# EAGLE design brake_light (EAGLE 8.4.3)
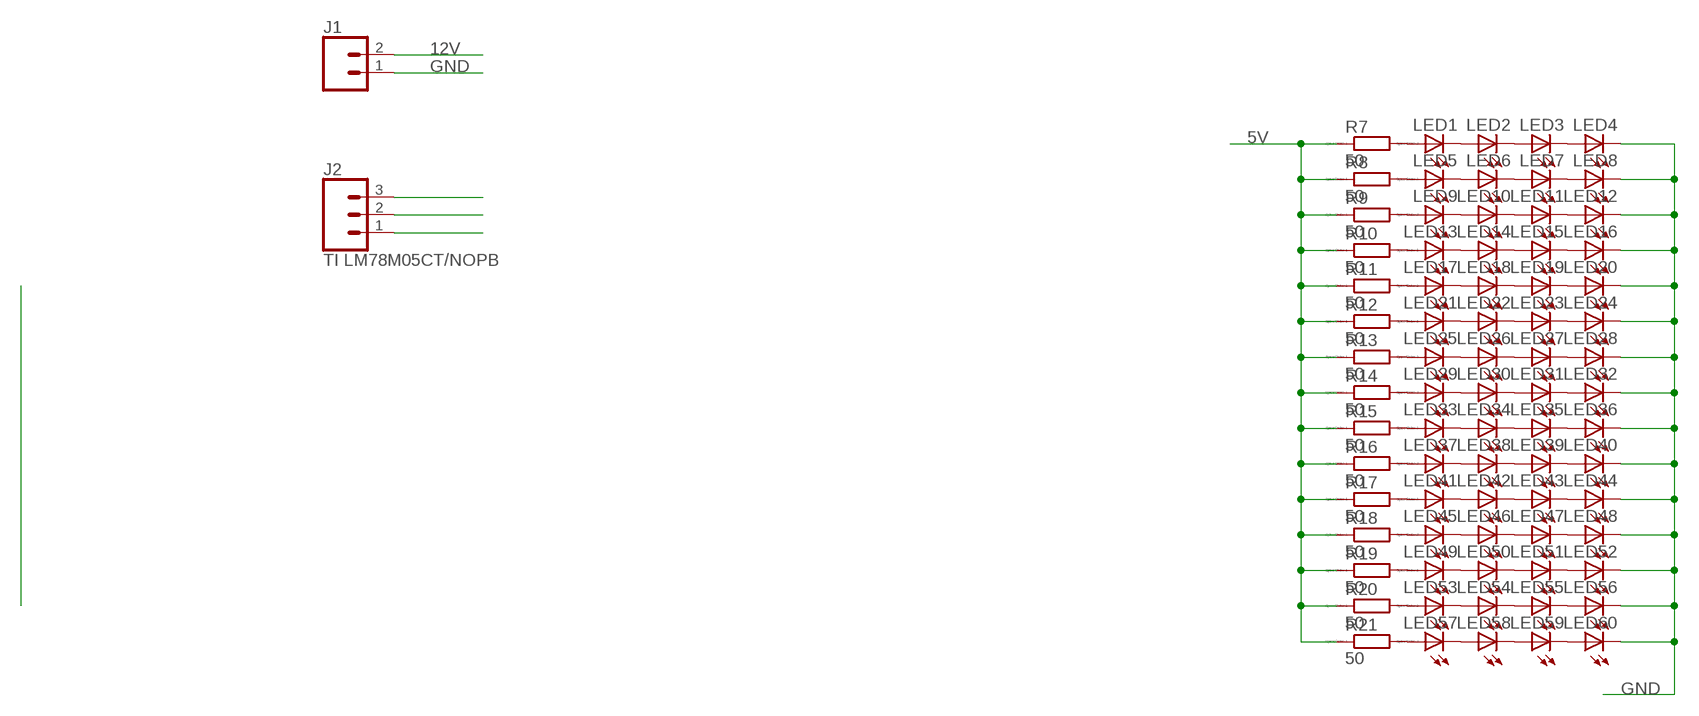
[diagram p0: schematic, sheet 1]

## Parts
J1  CONN_02  [1X02]
J2  TI LM78M05CT/NOPB  CONN_03  [1X03]
LED1  LED5MM  [LED5MM]
LED2  LED5MM  [LED5MM]
LED3  LED5MM  [LED5MM]
LED4  LED5MM  [LED5MM]
LED5  LED5MM  [LED5MM]
LED6  LED5MM  [LED5MM]
LED7  LED5MM  [LED5MM]
LED8  LED5MM  [LED5MM]
LED9  LED5MM  [LED5MM]
LED10  LED5MM  [LED5MM]
LED11  LED5MM  [LED5MM]
LED12  LED5MM  [LED5MM]
LED13  LED5MM  [LED5MM]
LED14  LED5MM  [LED5MM]
LED15  LED5MM  [LED5MM]
LED16  LED5MM  [LED5MM]
LED17  LED5MM  [LED5MM]
LED18  LED5MM  [LED5MM]
LED19  LED5MM  [LED5MM]
LED20  LED5MM  [LED5MM]
LED21  LED5MM  [LED5MM]
LED22  LED5MM  [LED5MM]
LED23  LED5MM  [LED5MM]
LED24  LED5MM  [LED5MM]
LED25  LED5MM  [LED5MM]
LED26  LED5MM  [LED5MM]
LED27  LED5MM  [LED5MM]
LED28  LED5MM  [LED5MM]
LED29  LED5MM  [LED5MM]
LED30  LED5MM  [LED5MM]
LED31  LED5MM  [LED5MM]
LED32  LED5MM  [LED5MM]
LED33  LED5MM  [LED5MM]
LED34  LED5MM  [LED5MM]
LED35  LED5MM  [LED5MM]
LED36  LED5MM  [LED5MM]
LED37  LED5MM  [LED5MM]
LED38  LED5MM  [LED5MM]
LED39  LED5MM  [LED5MM]
LED40  LED5MM  [LED5MM]
LED41  LED5MM  [LED5MM]
LED42  LED5MM  [LED5MM]
LED43  LED5MM  [LED5MM]
LED44  LED5MM  [LED5MM]
LED45  LED5MM  [LED5MM]
LED46  LED5MM  [LED5MM]
LED47  LED5MM  [LED5MM]
LED48  LED5MM  [LED5MM]
LED49  LED5MM  [LED5MM]
LED50  LED5MM  [LED5MM]
LED51  LED5MM  [LED5MM]
LED52  LED5MM  [LED5MM]
LED53  LED5MM  [LED5MM]
LED54  LED5MM  [LED5MM]
LED55  LED5MM  [LED5MM]
LED56  LED5MM  [LED5MM]
LED57  LED5MM  [LED5MM]
LED58  LED5MM  [LED5MM]
LED59  LED5MM  [LED5MM]
LED60  LED5MM  [LED5MM]
R7  50  RR1206  [R1206]
R8  50  RR1206  [R1206]
R9  50  RR1206  [R1206]
R10  50  RR1206  [R1206]
R11  50  RR1206  [R1206]
R12  50  RR1206  [R1206]
R13  50  RR1206  [R1206]
R14  50  RR1206  [R1206]
R15  50  RR1206  [R1206]
R16  50  RR1206  [R1206]
R17  50  RR1206  [R1206]
R18  50  RR1206  [R1206]
R19  50  RR1206  [R1206]
R20  50  RR1206  [R1206]
R21  50  RR1206  [R1206]

## Nets
5V: J2.3 R7.1 R8.1 R9.1 R10.1 R11.1 R12.1 R13.1 R14.1 R15.1 R16.1 R17.1 R18.1 R19.1 R20.1 R21.1
12V: J1.2 J2.1
GND: J1.1 J2.2 LED4.K(C) LED8.K(C) LED12.K(C) LED16.K(C) LED20.K(C) LED24.K(C) LED28.K(C) LED32.K(C) LED36.K(C) LED40.K(C) LED44.K(C) LED48.K(C) LED52.K(C) LED56.K(C) LED60.K(C)
N$10: LED1.A R7.2
N$11: LED1.K(C) LED2.A
N$12: LED2.K(C) LED3.A
N$13: LED3.K(C) LED4.A
N$14: LED5.A R8.2
N$15: LED5.K(C) LED6.A
N$16: LED6.K(C) LED7.A
N$17: LED7.K(C) LED8.A
N$18: LED9.A R9.2
N$19: LED9.K(C) LED10.A
N$20: LED10.K(C) LED11.A
N$21: LED11.K(C) LED12.A
N$22: LED13.A R10.2
N$23: LED13.K(C) LED14.A
N$24: LED14.K(C) LED15.A
N$25: LED15.K(C) LED16.A
N$26: LED17.A R11.2
N$27: LED17.K(C) LED18.A
N$28: LED18.K(C) LED19.A
N$29: LED19.K(C) LED20.A
N$30: LED21.A R12.2
N$31: LED21.K(C) LED22.A
N$32: LED22.K(C) LED23.A
N$33: LED23.K(C) LED24.A
N$34: LED25.A R13.2
N$35: LED25.K(C) LED26.A
N$36: LED26.K(C) LED27.A
N$37: LED27.K(C) LED28.A
N$38: LED29.A R14.2
N$39: LED29.K(C) LED30.A
N$40: LED30.K(C) LED31.A
N$41: LED31.K(C) LED32.A
N$42: LED33.A R15.2
N$43: LED33.K(C) LED34.A
N$44: LED34.K(C) LED35.A
N$45: LED35.K(C) LED36.A
N$46: LED37.A R16.2
N$47: LED37.K(C) LED38.A
N$48: LED38.K(C) LED39.A
N$49: LED39.K(C) LED40.A
N$50: LED41.A R17.2
N$51: LED41.K(C) LED42.A
N$52: LED42.K(C) LED43.A
N$53: LED43.K(C) LED44.A
N$54: LED45.A R18.2
N$55: LED45.K(C) LED46.A
N$56: LED46.K(C) LED47.A
N$57: LED47.K(C) LED48.A
N$58: LED49.A R19.2
N$59: LED49.K(C) LED50.A
N$60: LED50.K(C) LED51.A
N$61: LED51.K(C) LED52.A
N$62: LED53.A R20.2
N$63: LED53.K(C) LED54.A
N$64: LED54.K(C) LED55.A
N$65: LED55.K(C) LED56.A
N$66: LED57.A R21.2
N$67: LED57.K(C) LED58.A
N$68: LED58.K(C) LED59.A
N$69: LED59.K(C) LED60.A

## Library data of the parts
J1 = SparkFun-Connectors:CONN_02: Multi connection point. Often used as Generic Header-pin footprint for 0.1 inch spaced/style header connections On any of the 0.1 inch spaced packages, you can populate with these: Break Away Headers - Straight <https://www.sparkfun.com/products/116> (PRT-00116) Break Away Male Headers - Right Angle <https://www.sparkfun.com/products/553> (PRT-00553) Female Headers <https://www.sparkfun.com/products/115> (PRT-00115) Break Away Headers - Machine Pin <https://www.sparkfun.com/products/117> (PRT-00117) Break Away Female Headers - Swiss Machine Pin <https://www.sparkfun.com/products/743> (PRT-00743) For SCREWTERMINALS and SPRING TERMINALS visit here: Screw Terimnals on SparkFun.com <https://www.sparkfun.com/search/results?term=Screw+Terminals> (5mm/3.5mm/2.54mm spacing) This device is also useful as a general connection point to wire up your design to another part of your project. Our various solder wires solder well into these plated through hole pads. Hook-Up Wire - Assortment (Stranded, 22 AWG) <https://www.sparkfun.com/products/11375> (PRT-11375) Hook-Up Wire - Assortment (Solid Core, 22 AWG) <https://www.sparkfun.com/products/11367> (PRT-11367) View the entire wire category on our website here <https://www.sparkfun.com/categories/141> Special notes: Molex polarized connector foot print use with: PRT-08233 with associated crimp pins and housings. 2.54_SCREWTERM for use with PRT-10571. 3.5mm Screw Terminal footprints for PRT-08084 5mm Screw Terminal footprints for use with PRT-08432
J2 = SparkFun-Connectors:CONN_03: Multi connection point. Often used as Generic Header-pin footprint for 0.1 inch spaced/style header connections On any of the 0.1 inch spaced packages, you can populate with these: Break Away Headers - Straight <https://www.sparkfun.com/products/116> (PRT-00116) Break Away Male Headers - Right Angle <https://www.sparkfun.com/products/553> (PRT-00553) Female Headers <https://www.sparkfun.com/products/115> (PRT-00115) Break Away Headers - Machine Pin <https://www.sparkfun.com/products/117> (PRT-00117) Break Away Female Headers - Swiss Machine Pin <https://www.sparkfun.com/products/743> (PRT-00743) Stackable Header - 3 Pin (Female, 0.1") <https://www.sparkfun.com/products/13875> (PRT-13875) For SCREWTERMINALS and SPRING TERMINALS visit here: Screw Terimnals on SparkFun.com <https://www.sparkfun.com/search/results?term=Screw+Terminals> (5mm/3.5mm/2.54mm spacing) This device is also useful as a general connection point to wire up your design to another part of your project. Our various solder wires solder well into these plated through hole pads. Hook-Up Wire - Assortment (Stranded, 22 AWG) <https://www.sparkfun.com/products/11375> (PRT-11375) Hook-Up Wire - Assortment (Solid Core, 22 AWG) <https://www.sparkfun.com/products/11367> (PRT-11367) View the entire wire category on our website here <https://www.sparkfun.com/categories/141> Special notes: Molex polarized connector foot print use with SKU : PRT-08232 with associated crimp pins and housings.; PROD_ID: XXX-00000; VALUE: 455-1750-1-ND
LED1-LED60 = adafruit:LED: LED OSRAM: - CHIPLED LG R971, LG N971, LY N971, LG Q971, LY Q971, LO R971, LY R971 LH N974, LH R974 LS Q976, LO Q976, LY Q976 LO Q996 - Hyper CHIPLED LW Q18S LB Q993, LB Q99A, LB R99A - SideLED LS A670, LO A670, LY A670, LG A670, LP A670 LB A673, LV A673, LT A673, LW A673 LH A674 LY A675 LS A676, LA A676, LO A676, LY A676, LW A676 LS A679, LY A679, LG A679 - Hyper Micro SIDELED® LS Y876, LA Y876, LO Y876, LY Y876 LT Y87S - SmartLED LW L88C, LW L88S LB L89C, LB L89S, LG L890 LS L89K, LO L89K, LY L89K LS L896, LA L896, LO L896, LY L896 - TOPLED LS T670, LO T670, LY T670, LG T670, LP T670 LSG T670, LSP T670, LSY T670, LOP T670, LYG T670 LG T671, LOG T671, LSG T671 LB T673, LV T673, LT T673, LW T673 LH T674 LS T676, LA T676, LO T676, LY T676, LB T676, LH T676, LSB T676, LW T676 LB T67C, LV T67C, LT T67C, LS T67K, LO T67K, LY T67K, LW E67C LS E67B, LA E67B, LO E67B, LY E67B, LB E67C, LV E67C, LT E67C LW T67C LS T679, LY T679, LG T679 LS T770, LO T770, LY T770, LG T770, LP T770 LB T773, LV T773, LT T773, LW T773 LH T774 LS E675, LA E675, LY E675, LS T675 LS T776, LA T776, LO T776, LY T776, LB T776 LHGB T686 LT T68C, LB T68C - Hyper Mini TOPLED® LB M676 - Mini TOPLED Santana® LG M470 LS M47K, LO M47K, LY M47K Source: http://www.osram.convergy.de/
R7-R21 = eagle-ltspice:R: RESISTOR, European symbol; SPICEMODEL: NONE; SPICEPREFIX: R

## Board
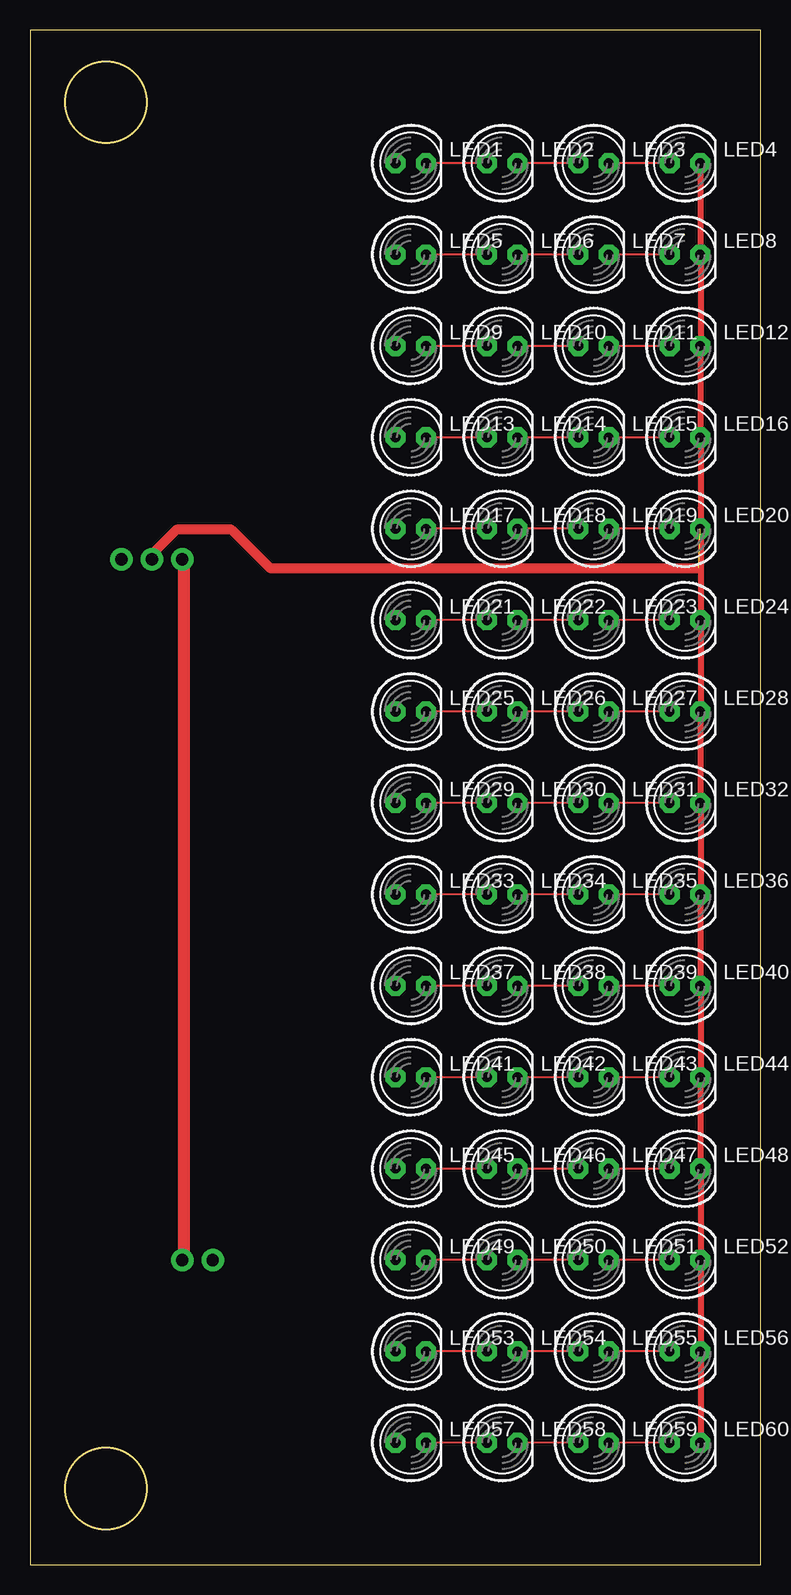
[diagram p1: board, top side]
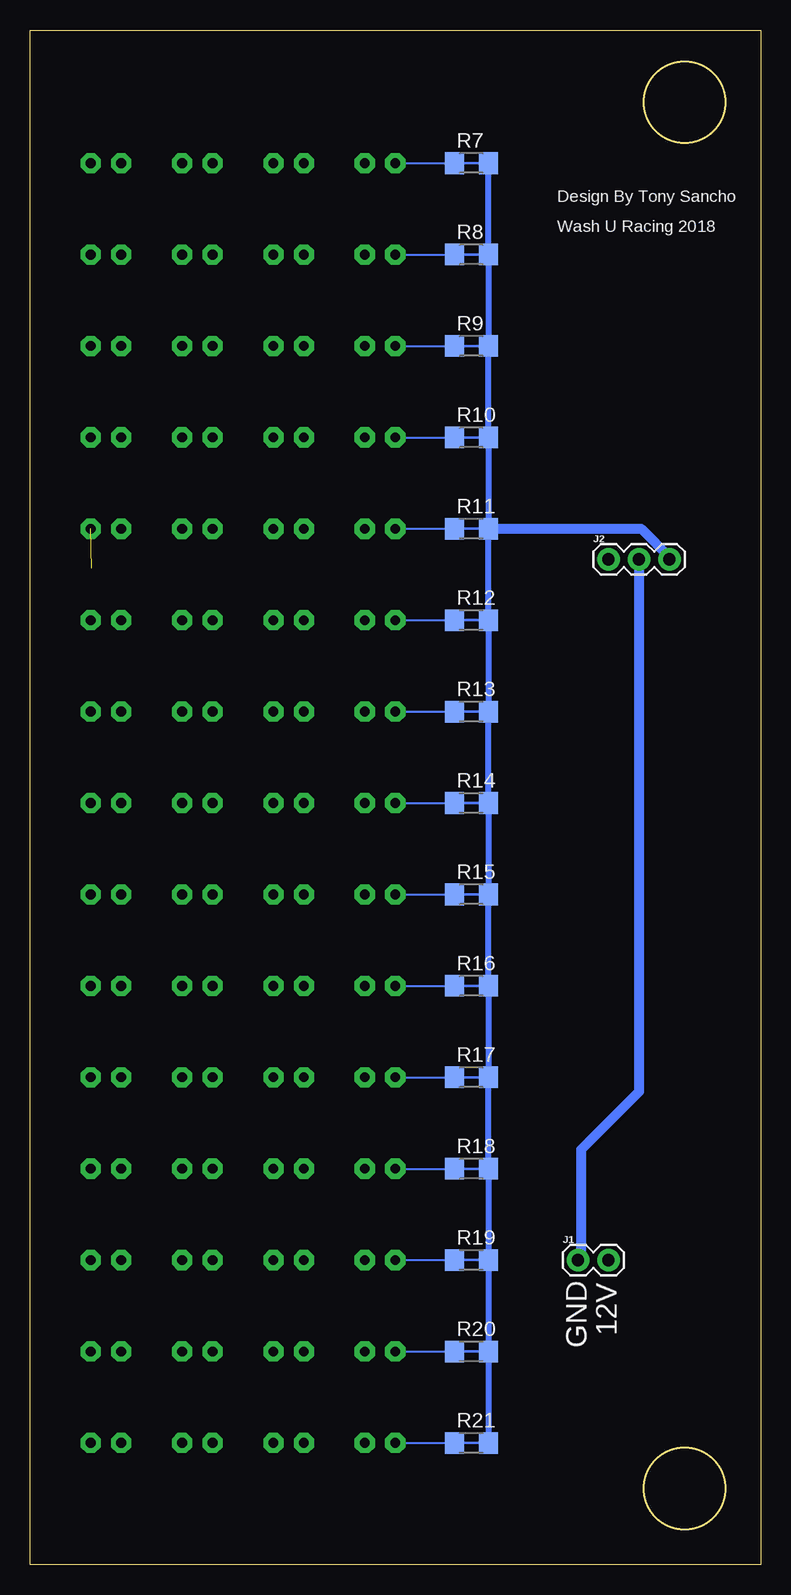
[diagram p2: board, bottom side, seen from below]

Size 60.94 x 127.94 mm. Coordinates in mm from the lower left corner, seen from the top.
Outline: 0,0 60.94,0 60.94,127.94 0,127.94 0,0
Outline: circle at 6.35,121.92 radius 3.4
Outline: circle at 6.35,6.35 radius 3.4
Copper layers (1*16): Top 0.035mm / dielectric 1.5mm / Bottom 0.035mm
Design rules "default": minimum track width 6mil, minimum drill 0.35mm, track to track 6mil, track to pad 6mil, pad to pad 6mil, via to via 6mil, smd to smd 6mil, copper to edge 40mil, drill to drill 6mil, minimum pad ring 10mil, minimum via ring 8mil, stop-mask expansion 4mil, vias tented up to drill 0mil, thermal gap 10mil

### Footprints (pad centres in the part's own frame; a part is rotated, then mirrored left to right if it is on the bottom)
1X02 = drill 1.016 pad 1.88: 1 0,0; 2 2.54,0
1X03 = drill 1.016 pad 1.88: 1 0,0; 2 2.54,0; 3 5.08,0
LED5MM = drill 0.813 pad 1.676 octagon: A -1.27,0; K 1.27,0
R1206 = smd 1.6 x 1.803: 1 -1.422,0; 2 1.422,0

### Placement (x,y rotation side)
J1  15.24,25.4 0 bottom
J2  12.7,83.82 0 bottom
LED1  31.75,116.84 0 top
LED2  39.37,116.84 0 top
LED3  46.99,116.84 0 top
LED4  54.61,116.84 0 top
LED5  31.75,109.22 0 top
LED6  39.37,109.22 0 top
LED7  46.99,109.22 0 top
LED8  54.61,109.22 0 top
LED9  31.75,101.6 0 top
LED10  39.37,101.6 0 top
LED11  46.99,101.6 0 top
LED12  54.61,101.6 0 top
LED13  31.75,93.98 0 top
LED14  39.37,93.98 0 top
LED15  46.99,93.98 0 top
LED16  54.61,93.98 0 top
LED17  31.75,86.36 0 top
LED18  39.37,86.36 0 top
LED19  46.99,86.36 0 top
LED20  54.61,86.36 0 top
LED21  31.75,78.74 0 top
LED22  39.37,78.74 0 top
LED23  46.99,78.74 0 top
LED24  54.61,78.74 0 top
LED25  31.75,71.12 0 top
LED26  39.37,71.12 0 top
LED27  46.99,71.12 0 top
LED28  54.61,71.12 0 top
LED29  31.75,63.5 0 top
LED30  39.37,63.5 0 top
LED31  46.99,63.5 0 top
LED32  54.61,63.5 0 top
LED33  31.75,55.88 0 top
LED34  39.37,55.88 0 top
LED35  46.99,55.88 0 top
LED36  54.61,55.88 0 top
LED37  31.75,48.26 0 top
LED38  39.37,48.26 0 top
LED39  46.99,48.26 0 top
LED40  54.61,48.26 0 top
LED41  31.75,40.64 0 top
LED42  39.37,40.64 0 top
LED43  46.99,40.64 0 top
LED44  54.61,40.64 0 top
LED45  31.75,33.02 0 top
LED46  39.37,33.02 0 top
LED47  46.99,33.02 0 top
LED48  54.61,33.02 0 top
LED49  31.75,25.4 0 top
LED50  39.37,25.4 0 top
LED51  46.99,25.4 0 top
LED52  54.61,25.4 0 top
LED53  31.75,17.78 0 top
LED54  39.37,17.78 0 top
LED55  46.99,17.78 0 top
LED56  54.61,17.78 0 top
LED57  31.75,10.16 0 top
LED58  39.37,10.16 0 top
LED59  46.99,10.16 0 top
LED60  54.61,10.16 0 top
R7  24.13,116.84 0 bottom
R8  24.13,109.22 0 bottom
R9  24.13,101.6 0 bottom
R10  24.13,93.98 0 bottom
R11  24.13,86.36 0 bottom
R12  24.13,78.74 0 bottom
R13  24.13,71.12 0 bottom
R14  24.13,63.5 0 bottom
R15  24.13,55.88 0 bottom
R16  24.13,48.26 0 bottom
R17  24.13,40.64 0 bottom
R18  24.13,33.02 0 bottom
R19  24.13,25.4 0 bottom
R20  24.13,17.78 0 bottom
R21  24.13,10.16 0 bottom

### Tracks (layer width: path | path; a pad name or v marks a point on that pad's centre or on a via)
5V  (via drill 0.35)
  Top 0.152: v7.53,83.92 7.62,83.92 J2.3
  Bottom 0.152: 22.71,116.84 R7.1 | 22.71,109.22 R8.1 | 22.71,101.6 R9.1 | 22.71,93.98 R10.1 | 22.71,10.16 R21.1 | 22.71,17.78 R20.1 | 22.71,25.4 R19.1 | 22.71,40.64 R17.1 | 22.71,33.02 R18.1 | 22.71,55.88 R15.1 | 22.71,48.26 R16.1 | 22.71,71.12 R13.1 | 22.71,63.5 R14.1 | 22.71,86.36 R11.1 | 22.71,78.74 R12.1
  Bottom 0.508: 22.71,116.84 22.71,109.22 22.71,101.6 22.71,93.98 22.71,86.36 22.71,78.74 22.71,71.12 22.71,63.5 22.71,55.88 22.71,48.26 22.71,40.64 22.71,33.02 22.71,25.4 22.71,17.78 22.71,10.16
  Bottom 0.813: v7.53,83.92 9.97,86.36 22.71,86.36
12V
  Top 0.152: 12.8,25.4 J1.2 | 12.8,83.77 J2.1
  Top 1.016: 12.8,83.77 12.8,25.4
GND  (via drill 0.35)  (1 unrouted)
  Top 0.152: 55.93,116.84 LED4.K | 55.93,109.22 LED8.K | 55.93,78.74 LED24.K | 55.93,86.36 LED20.K | 55.93,101.6 LED12.K | 55.93,93.98 LED16.K | 55.93,10.16 LED60.K | 55.93,17.78 LED56.K | 55.93,25.4 LED52.K | 55.93,40.64 LED44.K | 55.93,33.02 LED48.K | 55.93,55.88 LED36.K | 55.93,48.26 LED40.K | 55.93,71.12 LED28.K | 55.93,63.5 LED32.K
  Top 0.508: 55.93,116.84 55.93,109.22 55.93,101.6 55.93,93.98 55.93,88.09 | 55.93,78.59 55.93,78.74 | 55.93,78.59 55.93,71.12 55.93,63.5 55.93,55.88 55.93,48.26 55.93,40.64 55.93,33.02 55.93,25.4 55.93,17.78 55.93,10.16 | 55.93,88.09 55.93,86.36 | 55.93,88.09 55.93,78.59
  Top 0.813: v9.86,83.92 12.23,86.29 16.8,86.29 20,83.09 55.78,83.09
  Bottom 0.152: v9.86,83.92 10.21,83.92 J2.2 | 55.78,25.4 LED52.K
  Bottom 0.508: 15,25.64 J1.1
  Bottom 0.813: J2.2 10.16,39.43 15,34.59 15,25.64
N$10
  Bottom 0.152: LED1.A R7.2
N$11
  Top 0.152: LED2.A LED1.K
N$12
  Top 0.152: LED3.A LED2.K
N$13
  Top 0.152: LED4.A LED3.K
N$14
  Bottom 0.152: LED5.A R8.2
N$15
  Top 0.152: LED6.A LED5.K
N$16
  Top 0.152: LED7.A LED6.K
N$17
  Top 0.152: LED8.A LED7.K
N$18
  Bottom 0.152: LED9.A R9.2
N$19
  Top 0.152: LED10.A LED9.K
N$20
  Top 0.152: LED11.A LED10.K
N$21
  Top 0.152: LED12.A LED11.K
N$22
  Bottom 0.152: LED13.A R10.2
N$23
  Top 0.152: LED14.A LED13.K
N$24
  Top 0.152: LED15.A LED14.K
N$25
  Top 0.152: LED16.A LED15.K
N$26
  Bottom 0.152: LED17.A R11.2
N$27
  Top 0.152: LED18.A LED17.K
N$28
  Top 0.152: LED19.A LED18.K
N$29
  Top 0.152: LED20.A LED19.K
N$30
  Bottom 0.152: LED21.A R12.2
N$31
  Top 0.152: LED22.A LED21.K
N$32
  Top 0.152: LED23.A LED22.K
N$33
  Top 0.152: LED24.A LED23.K
N$34
  Bottom 0.152: LED25.A R13.2
N$35
  Top 0.152: LED26.A LED25.K
N$36
  Top 0.152: LED27.A LED26.K
N$37
  Top 0.152: LED28.A LED27.K
N$38
  Bottom 0.152: LED29.A R14.2
N$39
  Top 0.152: LED30.A LED29.K
N$40
  Top 0.152: LED31.A LED30.K
N$41
  Top 0.152: LED32.A LED31.K
N$42
  Bottom 0.152: LED33.A R15.2
N$43
  Top 0.152: LED34.A LED33.K
N$44
  Top 0.152: LED35.A LED34.K
N$45
  Top 0.152: LED36.A LED35.K
N$46
  Bottom 0.152: LED37.A R16.2
N$47
  Top 0.152: LED38.A LED37.K
N$48
  Top 0.152: LED39.A LED38.K
N$49
  Top 0.152: LED40.A LED39.K
N$50
  Bottom 0.152: LED41.A R17.2
N$51
  Top 0.152: LED42.A LED41.K
N$52
  Top 0.152: LED43.A LED42.K
N$53
  Top 0.152: LED44.A LED43.K
N$54
  Bottom 0.152: LED45.A R18.2
N$55
  Top 0.152: LED46.A LED45.K
N$56
  Top 0.152: LED47.A LED46.K
N$57
  Top 0.152: LED48.A LED47.K
N$58
  Bottom 0.152: LED49.A R19.2
N$59
  Top 0.152: LED50.A LED49.K
N$60
  Top 0.152: LED51.A LED50.K
N$61
  Top 0.152: LED52.A LED51.K
N$62
  Bottom 0.152: LED53.A R20.2
N$63
  Top 0.152: LED54.A LED53.K
N$64
  Top 0.152: LED55.A LED54.K
N$65
  Top 0.152: LED56.A LED55.K
N$66
  Bottom 0.152: LED57.A R21.2
N$67
  Top 0.152: LED58.A LED57.K
N$68
  Top 0.152: LED59.A LED58.K
N$69
  Top 0.152: LED60.A LED59.K

### Text on the board
_bsilk: Design By Tony Sancho | Wash U Racing 2018 | 12V | GND